# EasyEDA schematic SCH_HomeCon_2026-09-18.json
TITLE: Sheet_1; REV: 1.0; Date: 2026-09-18; Sheet: 1/1; Drawn By: acreyy; Company: Your Company
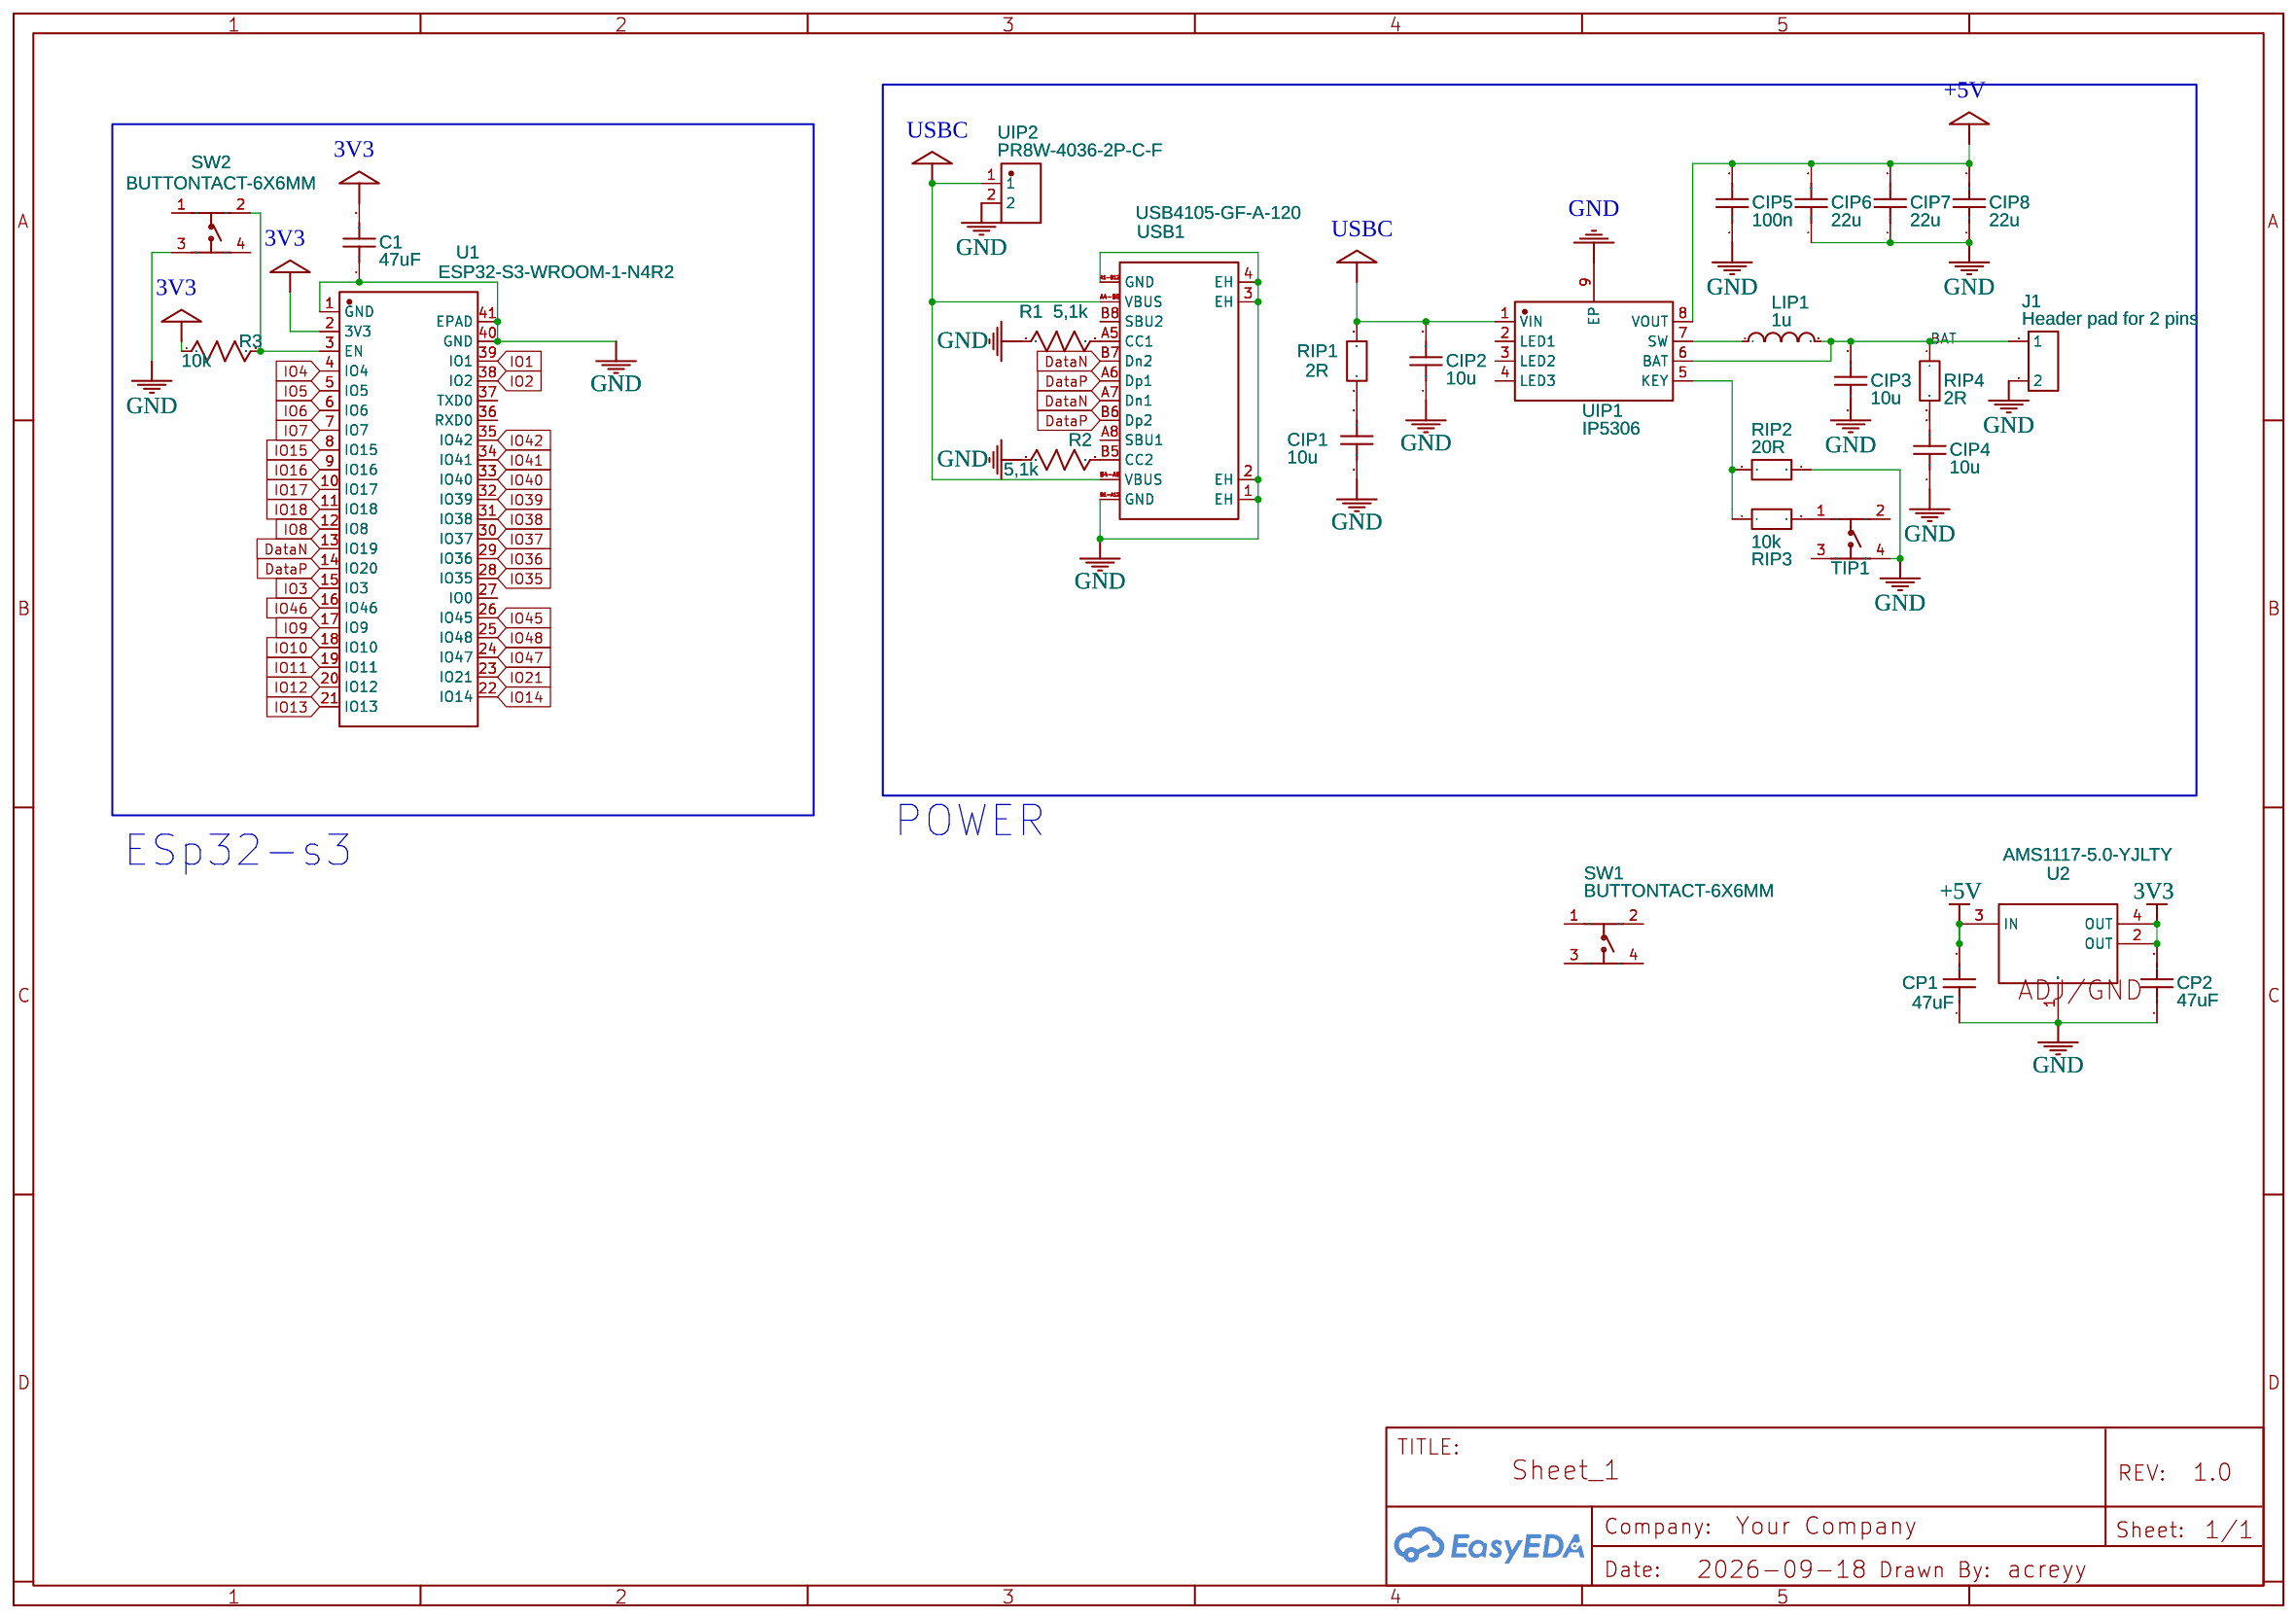
[diagram p0: schematic sheet]

## Parts
C1  47uF  [C0805]
CIP1  10u  [C0805]
CIP2  10u  [C0805]
CIP3  10u  [C0805]
CIP4  10u  [C0805]
CIP5  100n  [C0805]
CIP6  22u  [C0805]
CIP7  22u  [C0805]
CIP8  22u  [C0805]
CP1  47uF  [C0805]
CP2  47uF  [C0805]
J1  Header pad for 2 pins  [CONNECTOR_PINHEADER_2.54MM:PINHEADER_1X11_P_2.54MM]
LIP1  1u  [L_AXIAL-0.4]
R1  5,1k  [R0805]
R2  5,1k  [R0805]
R3  10k  [R0805]
RIP1  2R  [R0603]
RIP2  20R  [R0603]
RIP3  10k  [R0603]
RIP4  2R  [R0603]
SW1  BUTTONTACT-6X6MM  [SW-SMD_4P-L6.0-W6.0-P4.50-LS9.2]
SW2  BUTTONTACT-6X6MM  [SW-SMD_4P-L6.0-W6.0-P4.50-LS9.2]
TIP1  BUTTONTACT-6X6MM  [SW-SMD_4P-L6.0-W6.0-P4.50-LS9.2]
U1  ESP32-S3-WROOM-1-N4R2  [WIRELM-SMD_ESP32-S3-WROOM-1]
U2  AMS1117-5.0-YJLTY  [SOT-223-3_L6.7-W3.7-P2.30-LS7.0-BR]
UIP1  IP5306  [ESOP-8_L4.9-W3.9-P1.27-LS6.0-BL-EP]
UIP2  PR8W-4036-2P-C-F  [CONN-TH_PR8W-4036-2P-C-F]
USB1  USB4105-GF-A-120  [USB-C-SMD_MC-311D]

## Library data of the parts
C1 CIP1-CIP8 CP1 CP2 = C_0805_US: Contributor: LCEDA_Lib
J1 = HEADER PAD 2X: Manufacturer: BOOMELE; Manufacturer Part: Female headerHDR1X8-2.54; Supplier Part: C27438; JLCPCB Part Class: Extended Part; Contributor: papisdieng22
LIP1 = L_AXIAL-0.4_US: Contributor: LCEDA_Lib
R1-R3 = R_0805_US: Contributor: LCEDA_Lib
RIP1-RIP4 = R_0603_EU: Contributor: LCEDA_Lib
SW1 SW2 TIP1 = BUTTONTACT-6X6MM: Contributor: LCSC; Supplier: LCSC; Supplier Part: C9900004221; Manufacturer Part: Buttontact-6x6mm; Manufacturer: null; JLCPCB Part Class: Extended Part
U1 = ESP32-S3-WROOM-1-N4R2: Supplier: LCSC; Supplier Part: C2913203; Manufacturer: ESPRESSIF(乐鑫); JLCPCB Part Class: Extended Part; Contributor: lcsc
U2 = AMS1117-5.0-YJLTY: Contributor: lcsc; Supplier: LCSC; Supplier Part: C9900020131; Manufacturer: null; JLCPCB Part Class: Extended Part
UIP1 = IP5306: Contributor: LCSC; Supplier: LCSC; Supplier Part: C181692; Manufacturer: INJOINIC(英集芯); JLCPCB Part Class: Extended Part
UIP2 = PR8W-4036-2P-C-F: Supplier: LCSC; Supplier Part: C41361296; Manufacturer: SAMZO(三佐); Contributor: lcsc; JLCPCB Part Class: Extended Part
USB1 = USB4105-GF-A-120: Supplier: LCSC; Supplier Part: C5184243; Manufacturer: GCT; JLCPCB Part Class: Extended Part; Contributor: lcsc

## Nets
3V3: C1.2 CP2.2 R3.1 U1.2(3V3) U2.2(OUT) U2.4(OUT)
+5V: CIP5.2 CIP6.2 CIP7.2 CIP8.2 CP1.2 U2.3(IN) UIP1.8(VOUT)
GND: C1.1 CIP1.1 CIP2.1 CIP4.1 CIP5.1 CIP6.1 CIP7.1 CIP8.1 CP1.1 CP2.1 J1.2 R1.1 R2.1 RIP2.1 SW2.3(C) TIP1.4(D) U1.1(GND) U1.40(GND) U1.41(EPAD) U2.1(ADJ/GND) UIP1.9(EP) UIP2.2 USB1.1(EH) USB1.2(EH) USB1.3(EH) USB1.4(EH) USB1.A1-B12(GND) USB1.B1-A12(GND)
BAT: CIP3.2 J1.1 LIP1.2 RIP4.1 UIP1.6(BAT)
DataN: U1.13(IO19) USB1.A7(Dn1) USB1.B7(Dn2)
DataP: U1.14(IO20) USB1.A6(Dp1) USB1.B6(Dp2)
IO1: U1.39(IO1)
IO2: U1.38(IO2)
IO3: U1.15(IO3)
IO4: U1.4(IO4)
IO5: U1.5(IO5)
IO6: U1.6(IO6)
IO7: U1.7(IO7)
IO8: U1.12(IO8)
IO9: U1.17(IO9)
IO10: U1.18(IO10)
IO11: U1.19(IO11)
IO12: U1.20(IO12)
IO13: U1.21(IO13)
IO14: U1.22(IO14)
IO15: U1.8(IO15)
IO16: U1.9(IO16)
IO17: U1.10(IO17)
IO18: U1.11(IO18)
IO21: U1.23(IO21)
IO35: U1.28(IO35)
IO36: U1.29(IO36)
IO37: U1.30(IO37)
IO38: U1.31(IO38)
IO39: U1.32(IO39)
IO40: U1.33(IO40)
IO41: U1.34(IO41)
IO42: U1.35(IO42)
IO45: U1.26(IO45)
IO46: U1.16(IO46)
IO47: U1.24(IO47)
IO48: U1.25(IO48)
USBC: CIP2.2 RIP1.2 UIP1.1(VIN) UIP2.1 USB1.A4-B9(VBUS) USB1.B4-A9(VBUS)
Net-(CIP1-2): CIP1.2 RIP1.1
Net-(LIP1-1): LIP1.1 UIP1.7(SW)
Net-(R1-2): R1.2 USB1.A5(CC1)
Net-(R2-2): R2.2 USB1.B5(CC2)
Net-(R3-2): R3.2 SW2.2(B) U1.3(EN)
Net-(RIP2-2): RIP2.2 RIP3.1 UIP1.5(KEY)
Net-(RIP3-2): RIP3.2 TIP1.1(A)

Not connected (* = marked no-connect by the designer): CIP3 1; CIP4 2; RIP4 2; SW1 1(A) 2(B) 3(C) 4(D); SW2 1(A) 4(D); TIP1 2(B) 3(C); U1 27(IO0) 36(RXD0) 37(TXD0); UIP1 2(LED1) 3(LED2) 4(LED3); USB1 A8(SBU1) B8(SBU2)

## Notes on the sheet
- POWER
- ESp32-s3
